# EAGLE design iv12-driver-board-v1b (EAGLE 7.7.0)

## Sheet 1 of 2
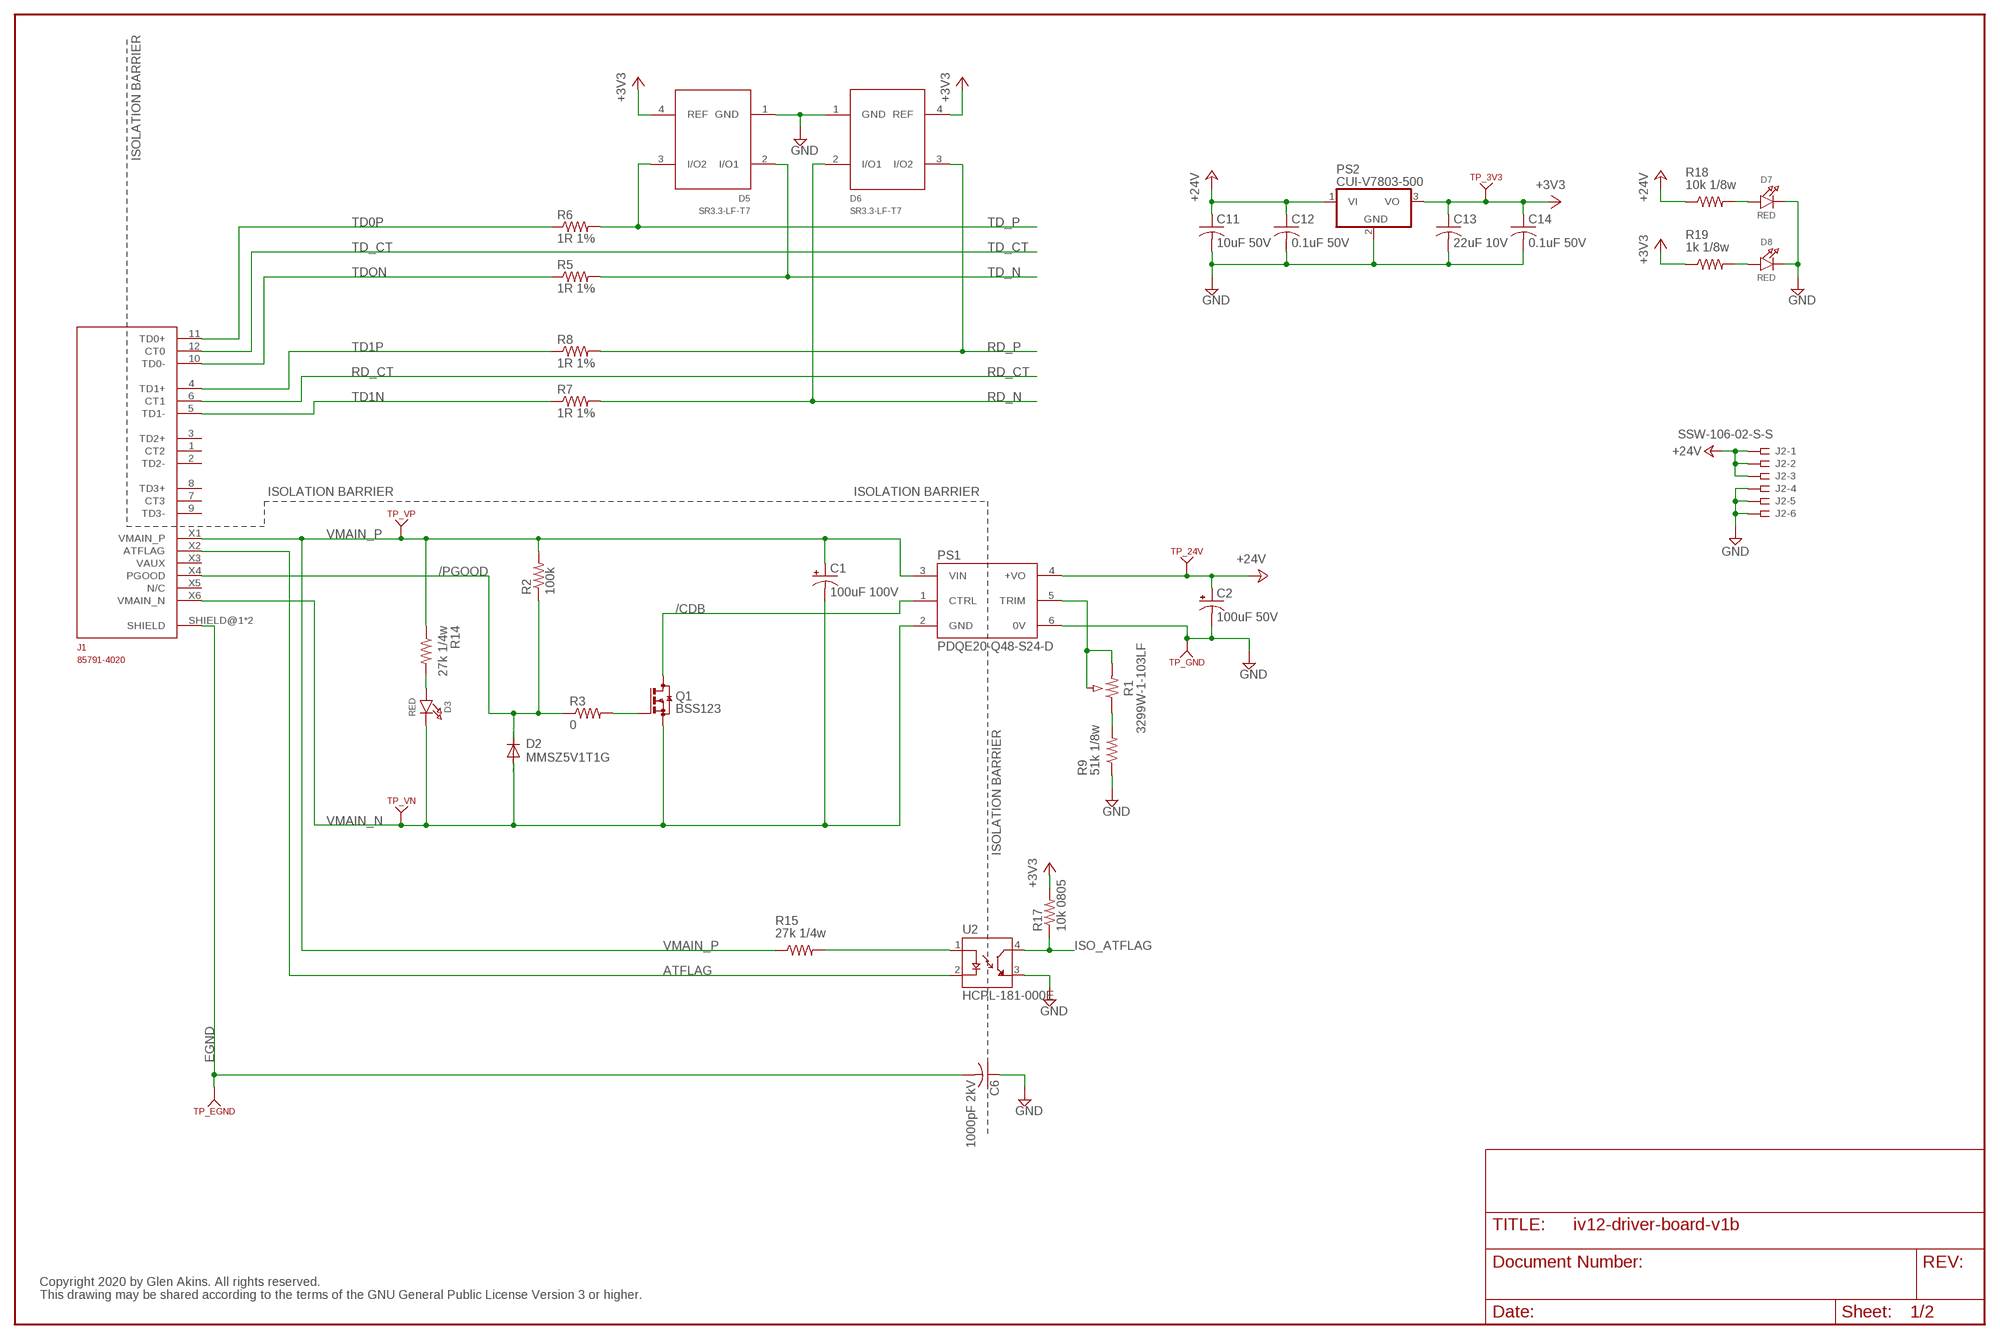
[diagram p0: schematic, sheet 1]

### Parts
C1  100uF 100V  CPOL-USE5-13  [E5-13]
C2  100uF 50V  CPOL-USE5-10.5  [E5-10,5]
C6  1000pF 2kV  C-USC1206K  [C1206K]
C11  10uF 50V  C-USC1210K  [C1210K]
C12  0.1uF 50V  C-USC0805  [C0805]
C13  22uF 10V  C-USC1206K  [C1206K]
C14  0.1uF 50V  C-USC0805  [C0805]
D2  MMSZ5V1T1G  DIODE-SOD123  [SOD123]
D3  RED  LED0805_NOOUTLINE  [CHIPLED_0805_NOOUTLINE]
D5  SR3.3-LF-T7  [SOT143B]
D6  SR3.3-LF-T7  [SOT143B]
D7  RED  LED0805_NOOUTLINE  [CHIPLED_0805_NOOUTLINE]
D8  RED  LED0805_NOOUTLINE  [CHIPLED_0805_NOOUTLINE]
J1  85791-4020  [85791-X020]
J2  SSW-106-02-S-S  [SSW-106-02-S-S]
PS1  PDQE20-Q48-S24-D  PDQE20-Q48-S5-D  [CONV_PDQE20-Q48-S5-D]
PS2  CUI-V7803-500  [CUI-78XX-500]
Q1  BSS123  [SOT23]
R1  3299W-1-103LF  [POT_3299W]
R2  100k  R-US_R0805  [R0805]
R3  0  R-US_R0805  [R0805]
R5  1R 1%  R-US_R0805  [R0805]
R6  1R 1%  R-US_R0805  [R0805]
R7  1R 1%  R-US_R0805  [R0805]
R8  1R 1%  R-US_R0805  [R0805]
R9  51k 1/8w  R-US_R0805  [R0805]
R14  27k 1/4w  R-US_R1206  [R1206]
R15  27k 1/4w  R-US_R1206  [R1206]
R17  10k 0805  R-US_R0805  [R0805]
R18  10k 1/8w  R-US_R0805  [R0805]
R19  1k 1/8w  R-US_R0805  [R0805]
TP_3V3  KEYSTONE_500X  [KEYSTONE_TP500X]
TP_24V  KEYSTONE_500X  [KEYSTONE_TP500X]
TP_EGND  KEYSTONE_500X  [KEYSTONE_TP500X]
TP_GND  KEYSTONE_500X  [KEYSTONE_TP500X]
TP_VN  KEYSTONE_500X  [KEYSTONE_TP500X]
TP_VP  KEYSTONE_500X  [KEYSTONE_TP500X]
U2  HCPL-181-000E  [SOIC254P675X240-4N]

### Nets
+3V3: C13.1 C14.1 D5.4(REF) D6.4(REF) PS2.3(VO) R17.2 R19.1 TP_3V3.1 ; also sheet 2
+24V: C2.+ C11.1 C12.1 J2.1 J2.2 J2.3 PS1.4(+VO) PS2.1(VI) R18.1 TP_24V.1
/CDB: PS1.1(CTRL) Q1.3(D)
/PGOOD: D2.C J1.X4(PGOOD) R2.1 R3.1
ATFLAG: J1.X2(ATFLAG) U2.2(CATHODE)
EGND: C6.2 J1.SHIELD@1(SHIELD) J1.SHIELD@2(SHIELD) TP_EGND.1
GND: C2.- C6.1 C11.2 C12.2 C13.2 C14.2 D5.1(GND) D6.1(GND) D7.C D8.C J2.4 J2.5 J2.6 PS1.6(0V) PS2.2(GND) R9.1 TP_GND.1 U2.3(EMITTER) ; also sheet 2
ISO_ATFLAG: R17.1 U2.4(COLLECTOR) ; also sheet 2
N$7: R1.1 R9.2
N$12: R15.2 U2.1(ANODE)
N$16: Q1.1(G) R3.2
N$22: D3.A R14.2
N$24: D7.A R18.2
N$25: D8.A R19.2
RD_CT: J1.6(CT1) ; also sheet 2
RD_N: D6.2(I/O1) R7.2 ; also sheet 2
RD_P: D6.3(I/O2) R8.2 ; also sheet 2
TD0P: J1.11(TD0+) R6.1
TD1N: J1.5(TD1-) R7.1
TD1P: J1.4(TD1+) R8.1
TD_CT: J1.12(CT0) ; also sheet 2
TD_N: D5.2(I/O1) R5.2 ; also sheet 2
TD_P: D5.3(I/O2) R6.2 ; also sheet 2
TDON: J1.10(TD0-) R5.1
V24ADJ: PS1.5(TRIM) R1.2 R1.3
VMAIN_N: C1.- D2.A D3.C J1.X6(VMAIN_N) PS1.2(GND) Q1.2(S) TP_VN.1
VMAIN_P: C1.+ J1.X1(VMAIN_P) PS1.3(VIN) R2.2 R14.1 R15.1 TP_VP.1
Unconnected: J1.1(CT2) J1.2(TD2-) J1.3(TD2+) J1.7(CT3) J1.8(TD3+) J1.9(TD3-) J1.X3(VAUX) J1.X5(N/C)

### Notes on the sheet
- ISOLATION BARRIER
- ISOLATION BARRIER | ISOLATION BARRIER
- ISOLATION BARRIER
- Copyright 2020 by Glen Akins. All rights reserved.
  This drawing may be shared according to the terms of the GNU General Public License Version 3 or higher.

## Sheet 2 of 2
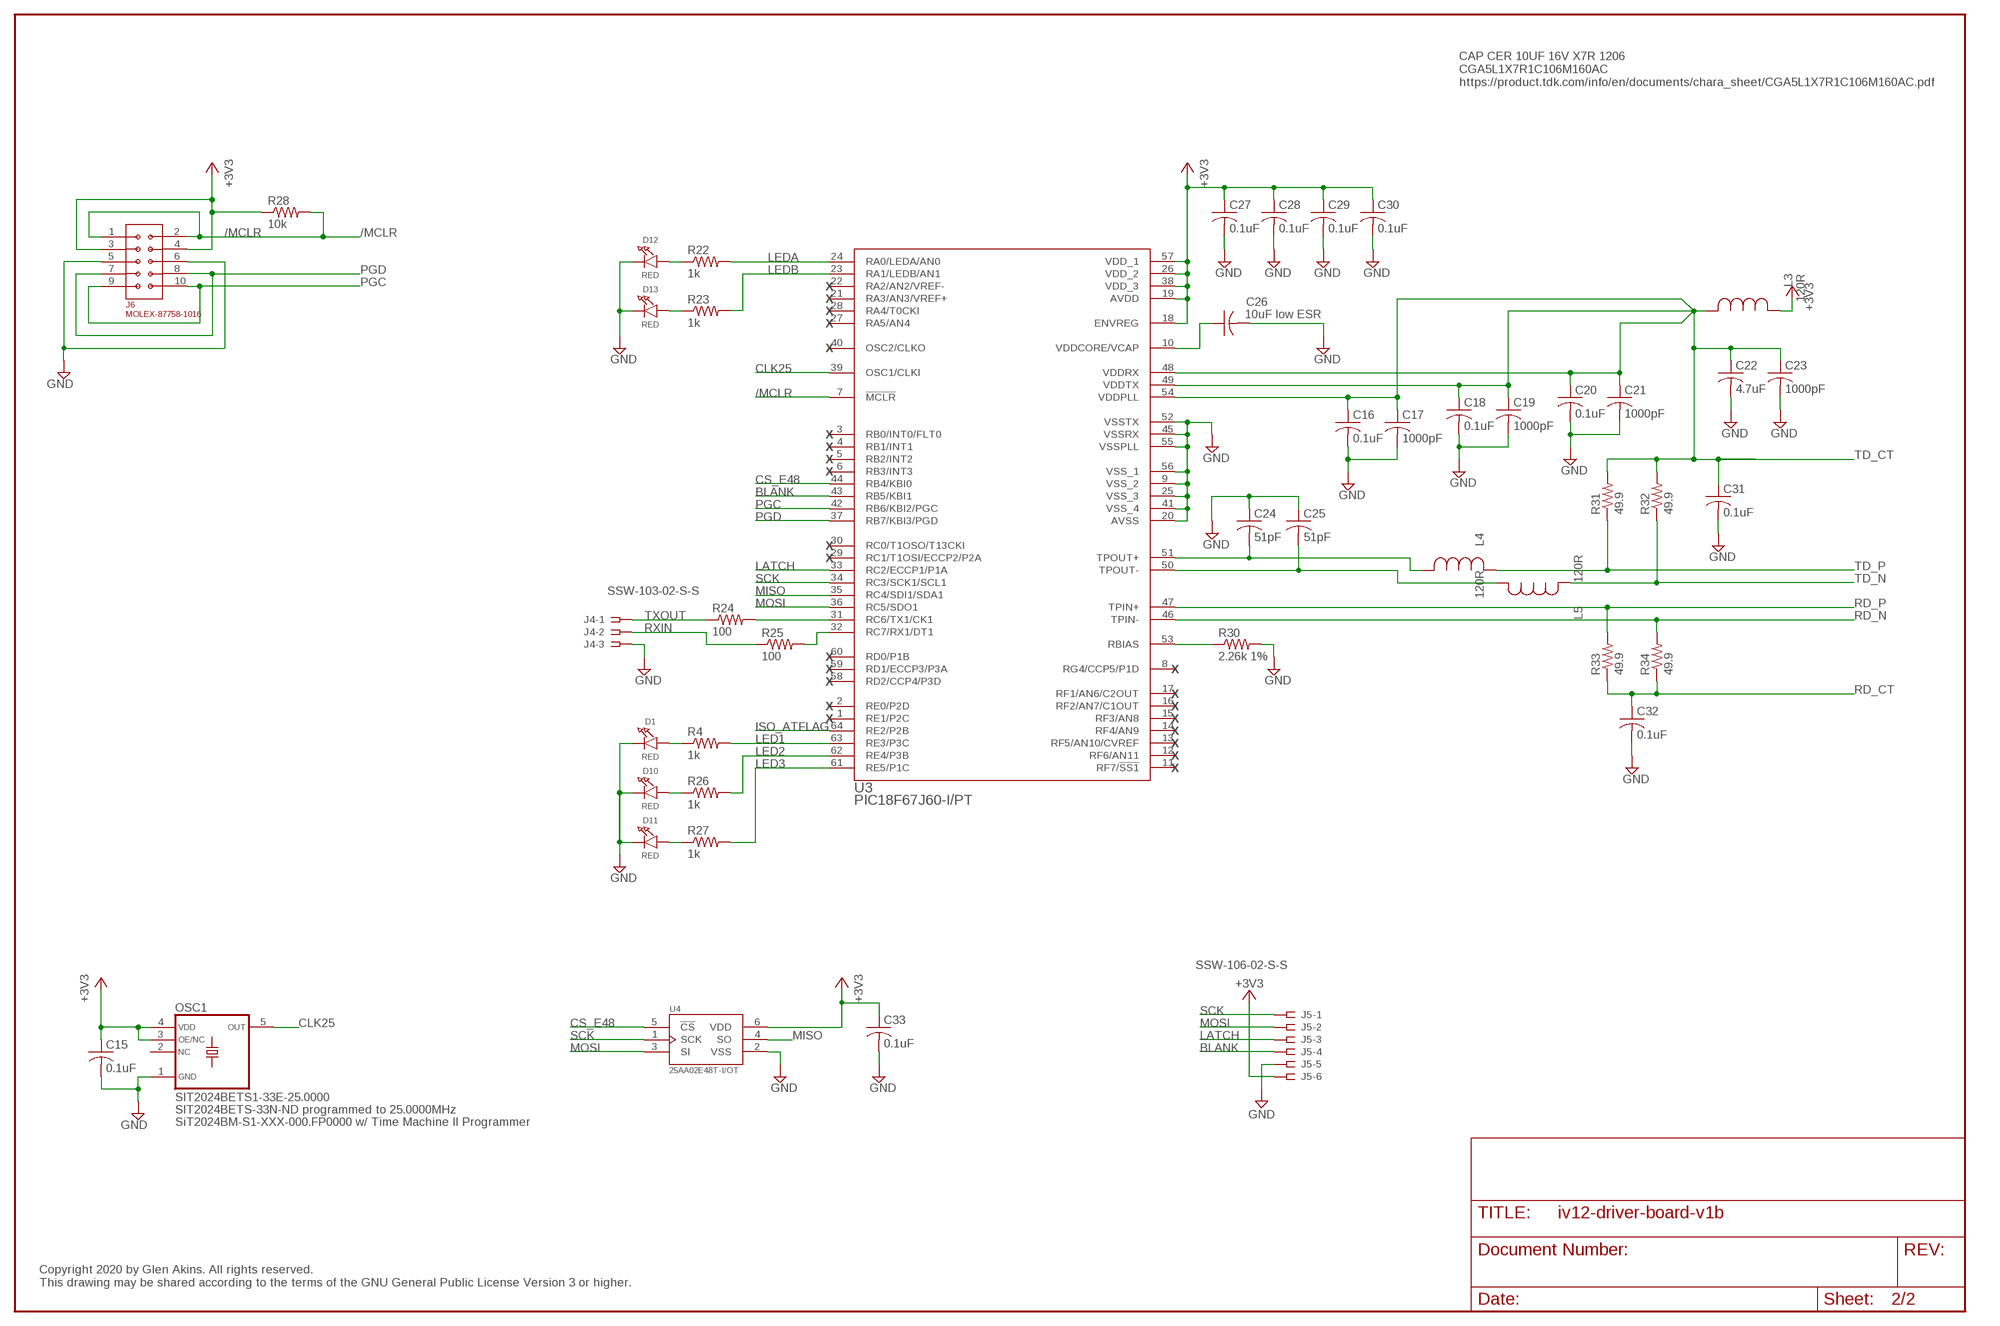
[diagram p1: schematic, sheet 2]

### Parts
C15  0.1uF  C-USC0603  [C0603]
C16  0.1uF  C-USC0805  [C0805]
C17  1000pF  C-USC0805  [C0805]
C18  0.1uF  C-USC0805  [C0805]
C19  1000pF  C-USC0805  [C0805]
C20  0.1uF  C-USC0805  [C0805]
C21  1000pF  C-USC0805  [C0805]
C22  4.7uF  C-USC0805  [C0805]
C23  1000pF  C-USC0805  [C0805]
C24  51pF  C-USC0805  [C0805]
C25  51pF  C-USC0805  [C0805]
C26  10uF low ESR  C-USC1206  [C1206]
C27  0.1uF  C-USC0603  [C0603]
C28  0.1uF  C-USC0603  [C0603]
C29  0.1uF  C-USC0603  [C0603]
C30  0.1uF  C-USC0603  [C0603]
C31  0.1uF  C-USC0805  [C0805]
C32  0.1uF  C-USC0805  [C0805]
C33  0.1uF  C-USC0603  [C0603]
D1  RED  LED0805_NOOUTLINE  [CHIPLED_0805_NOOUTLINE]
D10  RED  LED0805_NOOUTLINE  [CHIPLED_0805_NOOUTLINE]
D11  RED  LED0805_NOOUTLINE  [CHIPLED_0805_NOOUTLINE]
D12  RED  LED0805_NOOUTLINE  [CHIPLED_0805_NOOUTLINE]
D13  RED  LED0805_NOOUTLINE  [CHIPLED_0805_NOOUTLINE]
J4  SSW-103-02-S-S  [SSW-103-02-S-S]
J5  SSW-106-02-S-S  [SSW-106-02-S-S]
J6  MOLEX-87758-1016  CON-2MM-2X5-MOLEX-87758-1016  [CON-2MM-2X5]
L3  120R  MMZ1608B121CTAH0IND_1608-M  [IND_1608-M]
L4  120R  MMZ1608B121CTAH0IND_1608-M  [IND_1608-M]
L5  120R  MMZ1608B121CTAH0IND_1608-M  [IND_1608-M]
OSC1  SIT2024BETS1-33E-25.0000  SIT2024BETS1-33E-10.0000  [SOT23-5]
R4  1k  R-US_R0805  [R0805]
R22  1k  R-US_R0805  [R0805]
R23  1k  R-US_R0805  [R0805]
R24  100  R-US_R0805  [R0805]
R25  100  R-US_R0805  [R0805]
R26  1k  R-US_R0805  [R0805]
R27  1k  R-US_R0805  [R0805]
R28  10k  R-US_R0805  [R0805]
R30  2.26k 1%  R-US_R0805  [R0805]
R31  49.9  R-US_R0805  [R0805]
R32  49.9  R-US_R0805  [R0805]
R33  49.9  R-US_R0805  [R0805]
R34  49.9  R-US_R0805  [R0805]
U3  PIC18F67J60-I/PT  [TQFP64_10X10MC]
U4  25AA02E48T-I/OT  [SOT95P270X145-6N]

### Nets
+3V3: C15.1 C27.1 C28.1 C29.1 C30.1 C33.1 J5.6 J6.3 J6.4 L3.2 OSC1.3(OE/NC) OSC1.4(VDD) R28.1 U3.18(ENVREG) U3.19(AVDD) U3.26(VDD_2) U3.38(VDD_3) U3.57(VDD_1) U4.6(VDD) ; also sheet 1
/MCLR: J6.1 J6.2 R28.2 U3.7(!MCLR)
BLANK: J5.4 U3.43(RB5/KBI1)
CLK25: OSC1.5(OUT) U3.39(OSC1/CLKI)
CS_E48: U3.44(RB4/KBI0) U4.5(!CS)
GND: C15.2 C16.2 C17.2 C18.2 C19.2 C20.2 C21.2 C22.2 C23.2 C24.1 C25.1 C26.2 C27.2 C28.2 C29.2 C30.2 C31.2 C32.2 C33.2 D1.C D10.C D11.C D12.C D13.C J4.3 J5.5 J6.5 J6.6 OSC1.1(GND) R30.2 U3.9(VSS_2) U3.20(AVSS) U3.25(VSS_3) U3.41(VSS_4) U3.45(VSSRX) U3.52(VSSTX) U3.55(VSSPLL) U3.56(VSS_1) U4.2(VSS) ; also sheet 1
ISO_ATFLAG: U3.64(RE2/P2B) ; also sheet 1
LATCH: J5.3 U3.33(RC2/ECCP1/P1A)
LED1: R4.2 U3.63(RE3/P3C)
LED2: R26.2 U3.62(RE4/P3B)
LED3: R27.2 U3.61(RE5/P1C)
LEDA: R22.2 U3.24(RA0/LEDA/AN0)
LEDB: R23.2 U3.23(RA1/LEDB/AN1)
MISO: U3.35(RC4/SDI1/SDA1) U4.4(SO)
MOSI: J5.2 U3.36(RC5/SDO1) U4.3(SI)
N$1: D1.A R4.1
N$9: R30.1 U3.53(RBIAS)
N$10: D13.A R23.1
N$11: D10.A R26.1
N$18: D11.A R27.1
N$21: D12.A R22.1
PGC: J6.9 J6.10 U3.42(RB6/KBI2/PGC)
PGD: J6.7 J6.8 U3.37(RB7/KBI3/PGD)
RD_CT: C32.1 R33.1 R34.1 ; also sheet 1
RD_N: R34.2 U3.46(TPIN-) ; also sheet 1
RD_P: R33.2 U3.47(TPIN+) ; also sheet 1
RXD: R25.2 U3.32(RC7/RX1/DT1)
RXIN: J4.2 R25.1
SCK: J5.1 U3.34(RC3/SCK1/SCL1) U4.1(SCK)
TD_CT: C16.1 C17.1 C18.1 C19.1 C20.1 C21.1 C22.1 C23.1 C31.1 L3.1 R31.2 R32.2 U3.48(VDDRX) U3.49(VDDTX) U3.54(VDDPLL) ; also sheet 1
TD_N: L5.2 R32.1 ; also sheet 1
TD_P: L4.2 R31.1 ; also sheet 1
TDF_N: C25.2 L5.1 U3.50(TPOUT-)
TDF_P: C24.2 L4.1 U3.51(TPOUT+)
TXD: R24.2 U3.31(RC6/TX1/CK1)
TXOUT: J4.1 R24.1
VCAP: C26.1 U3.10(VDDCORE/VCAP)
Unconnected: OSC1.2(NC) U3.1(RE1/P2C) U3.2(RE0/P2D) U3.3(RB0/INT0/FLT0) U3.4(RB1/INT1) U3.5(RB2/INT2) U3.6(RB3/INT3) U3.8(RG4/CCP5/P1D) U3.11(RF7/!SS1) U3.12(RF6/AN11) U3.13(RF5/AN10/CVREF) U3.14(RF4/AN9) U3.15(RF3/AN8) U3.16(RF2/AN7/C1OUT) U3.17(RF1/AN6/C2OUT) U3.21(RA3/AN3/VREF+) U3.22(RA2/AN2/VREF-) U3.27(RA5/AN4) U3.28(RA4/T0CKI) U3.29(RC1/T1OSI/ECCP2/P2A) U3.30(RC0/T1OSO/T13CKI) U3.40(OSC2/CLKO) U3.58(RD2/CCP4/P3D) U3.59(RD1/ECCP3/P3A) U3.60(RD0/P1B)

### Notes on the sheet
- CAP CER 10UF 16V X7R 1206
  CGA5L1X7R1C106M160AC 
  https://product.tdk.com/info/en/documents/chara_sheet/CGA5L1X7R1C106M160AC.pdf
- X
- X
- X
- X
- X
- X
- X
- X
- X
- X
- X
- X
- X | X
- X
- X
- X | X
- X | X
- X
- X
- X
- X
- SIT2024BETS-33N-ND programmed to 25.0000MHz
- SiT2024BM-S1-XXX-000.FP0000 w/ Time Machine II Programmer
- Copyright 2020 by Glen Akins. All rights reserved.
  This drawing may be shared according to the terms of the GNU General Public License Version 3 or higher.

## Library data of the parts
C1 C2 = rcl:CPOL-US: POLARIZED CAPACITOR, American symbol
C6 C15-C25 C27-C33 = rcl:C-US: CAPACITOR, American symbol
C11 = rcl:C-US: CAPACITOR, American symbol; MFR: KEMET; MFR_PART_NO: C1210C106K5RACTU
C12 C14 = rcl:C-US: CAPACITOR, American symbol; MFR: KEMET; MFR_PART_NO: C1206S104M5RACTU
C13 = rcl:C-US: CAPACITOR, American symbol; MFR: KEMET; MFR_PART_NO: C1206C226K8RAC7800
C26 = resistor:C-US: CAPACITOR, American symbol
D1 D3 D7 D8 D10-D13 = microbuilder:LED: LED 0603 - 0603 Surface Mount Package 2mA: Green LED - Low Power (3.9mcd, 2ma, 1.7Vf) - Digikey: 475-2709-2-ND Orange LED - Low Power (9.8mcd, 2ma, 1.8Vf) - Digikey: 475-1194-2-ND Red LED - Low Power (5mcd, 2ma, 1.8Vf) - Digikey: 475-1195-2-ND Yellow LED - Low Power (7mcd, 2ma, 1.8Vf) - Digikey: 475-1196-2-ND 5mA: Blue LED - Low Power (17mcd, 5ma, 2.9Vf) - Digikey: LNJ937W8CRACT-ND 0805 - 0805 Surface Mount Package 2mA: Red LED (8.8mcd, 2mA, 1.8Vf, Clear) - Low Power [Digikey: 475-2510-1-ND] Green LED (5mcd, 2mA, 1.8Vf, Clear) - Low Power [Digikey: 475-2730-1-ND] Yellow LED (11.3mcd, 2mA, 1.8Vf, Clear) - Low Power [Digikey: 475-2555-1-ND] 20mA: Red LED (104mcd, 20mA, Diffused) - LS R976 [Digikey: 475-1278-6-ND] Red LED (12mcd, 20mA, 2.0Vf, Clear) - APT2012EC [Digikey: 754-1128-1-ND] Green LED (15mcd, 20mA, 2.2Vf, Clear) - APT2012GC [Digikey: 754-1131-1-ND] Orange LED (160mcd, 20mA, 2.1Vf, Clear) - APT2012SECK [Digikey: 754-1130-1-ND] 1206 - 1206 Surface Mount Package Green LED (26mcd, 20mA, Diffused) - LG N971 [Digikey: 475-1407-6-ND] Red LED (15mcd, 20mA, Diffused) - LH N974 [Digikey: 475-1416-6-ND] Cree - Cree High-Power Surface Mount LEDs XPEBWT-L1-0000-00D50 - White 111lm 350mA 2.9Vf 6200K 110° XTEAWT-00-0000-00000LEE3 - White 114lm 350mA 2.85Vf 5000K 115° Everlight - Everlight 45-21 Series Surface Mount LEDs 45-21/QK2C-B2832AC2CB2/2T - Warm White 2000mcd 20mA 3.25Vf 3050K 120° 45-21/LK2C-B38452C4CB2/2T - Nuetral White 2000mcd 20mA 3.25Vf 4150K 120° 45-21/LK2C-B50634C6CB2/2T - Cold White 2200mcd 20mA 3.25Vf 5650K 120° PLCC2 Reverse Mount LS T77K-J1L2-1-0-2-R18-Z - Red 11.25mcd 2mA 1.8Vf 630nm 120° LO T77K-L1M2-24-Z - Orange 19.6mcd 2mA 1.8Vf 606nm 120° LY T77K-K2M1-26-Z - Yellow 15.7mcd 2mA 1.8Vf 587nm 120°
D2 = diode:DIODE-: DIODE
D5 D6 = protek-devices:SR3.3-LF-T7
J1 = Molex 85791-X020:85791-4020
J2 J5 = con-samtec:SSW-106-02-S-S: THROUGH-HOLE .025" SQ POST SOCKET Source: Samtec SSW.pdf; MPN: SSW-106-02-S-S; OC_FARNELL: unknown; OC_NEWARK: 11P9416
J4 = con-samtec:SSW-103-02-S-S: THROUGH-HOLE .025" SQ POST SOCKET Source: Samtec SSW.pdf; MPN: SSW-103-02-S-S; OC_FARNELL: unknown; OC_NEWARK: 11P9367
J6 = 0GlenConnectors:CON-2MM-2X5-MOLEX-87758-1016; MFR: MOLEX; MFR_PART_NO: 87758-1016
L3-L5 = MMZ1608B121CTAH0:MMZ1608B121CTAH0; BUILT_BY: EMA_UL_Team; MANUFACTURER_PART_NUMBER: MMZ1608B121CTAH0; VENDOR: TDK
OSC1 = Glen-SiTime:SIT2024BETS1-33E-10.0000
PS1 = PDQE20-Q48-S5-D:PDQE20-Q48-S5-D: 20 W, 4:1 Input Range, Single/Dual Regulated Output, DIP, 1500 Vdc Isolation, DC-Dc Converter; CUI_PURCHASE_URL: https://www.cui.com/product/dc-dc-converters/isolated/pdqe20-d-series?utm_source=snapeda.com&utm_medium=referral&utm_campaign=snapedaBOM; DESCRIPTION: 20 W, 4:1 Input Range, Single/Dual Regulated Output, DIP, 1500 Vdc Isolation, Dc-Dc Converter; DIGI-KEY_PART_NUMBER: 102-6272-ND; DIGI-KEY_PURCHASE_URL: https://www.digikey.com/product-detail/en/cui-inc/PDQE20-Q48-S5-D/102-6272-ND/10230161?utm_source=snapeda&utm_medium=aggregator&utm_campaign=symbol; MF: CUI Inc.; MP: PDQE20-Q48-S5-D; PACKAGE: DIP-6 CUI Inc.
PS2 = GlenPartsLibrary:CUI-V7803-500
Q1 = transistor-small-signal:BSS123: N-CHANNEL MOS FET
R1 = bourns-3299w:3299W-1-103LF
R2 R3 R17 = resistor:R-US_: RESISTOR, American symbol
R4-R9 R14 R15 R18 R19 R22-R28 R30-R34 = rcl:R-US_: RESISTOR, American symbol
TP_3V3 TP_24V TP_EGND TP_GND TP_VN TP_VP = 0GlenConnectors:KEYSTONE_500X
U2 = HCPL-181-000E:HCPL-181-000E: Optocoupler; SMD; Channels: 1; Out: transistor; Uinsul: 3.75kV; SO4; DESCRIPTION: Optocoupler; SMD; Channels: 1; Out: transistor; Uinsul: 3.75kV; SO4; DIGI-KEY_PART_NUMBER: 516-1646-1-ND; DIGI-KEY_PURCHASE_URL: https://www.digikey.com/product-detail/en/broadcom-limited/HCPL-181-000E/516-1646-1-ND/825340?utm_source=snapeda&utm_medium=aggregator&utm_campaign=symbol; MF: Broadcom Limited; MP: HCPL-181-000E; PACKAGE: SO-4 Broadcom
U3 = pic18f67j60:PIC18F67J60-I/PT; MANUFACTURER_PART_NUMBER: PIC18F67J60IPT; VENDOR: Microchip
U4 = 25AA02E48T-I_OT:25AA02E48T-I/OT: 25AA02E48 Series 2 Kbit (256 x 8) 5.5 V SMT SPI Bus Serial EEPROM - SOT-23-6; DESCRIPTION: 25AA02E48 Series 2 Kbit _256 x 8_ 5.5 V SMT SPI Bus Serial EEPROM - SOT-23-6; DIGI-KEY_PART_NUMBER: 25AA02E48T-I/OTCT-ND; DIGI-KEY_PURCHASE_URL: https://www.digikey.com/product-detail/en/microchip-technology/25AA02E48T-I-OT/25AA02E48T-I-OTCT-ND/2060055?utm_source=snapeda&utm_medium=aggregator&utm_campaign=symbol; MF: Microchip; MP: 25AA02E48T-I/OT; PACKAGE: SOT-23-6 Microchip

## Board
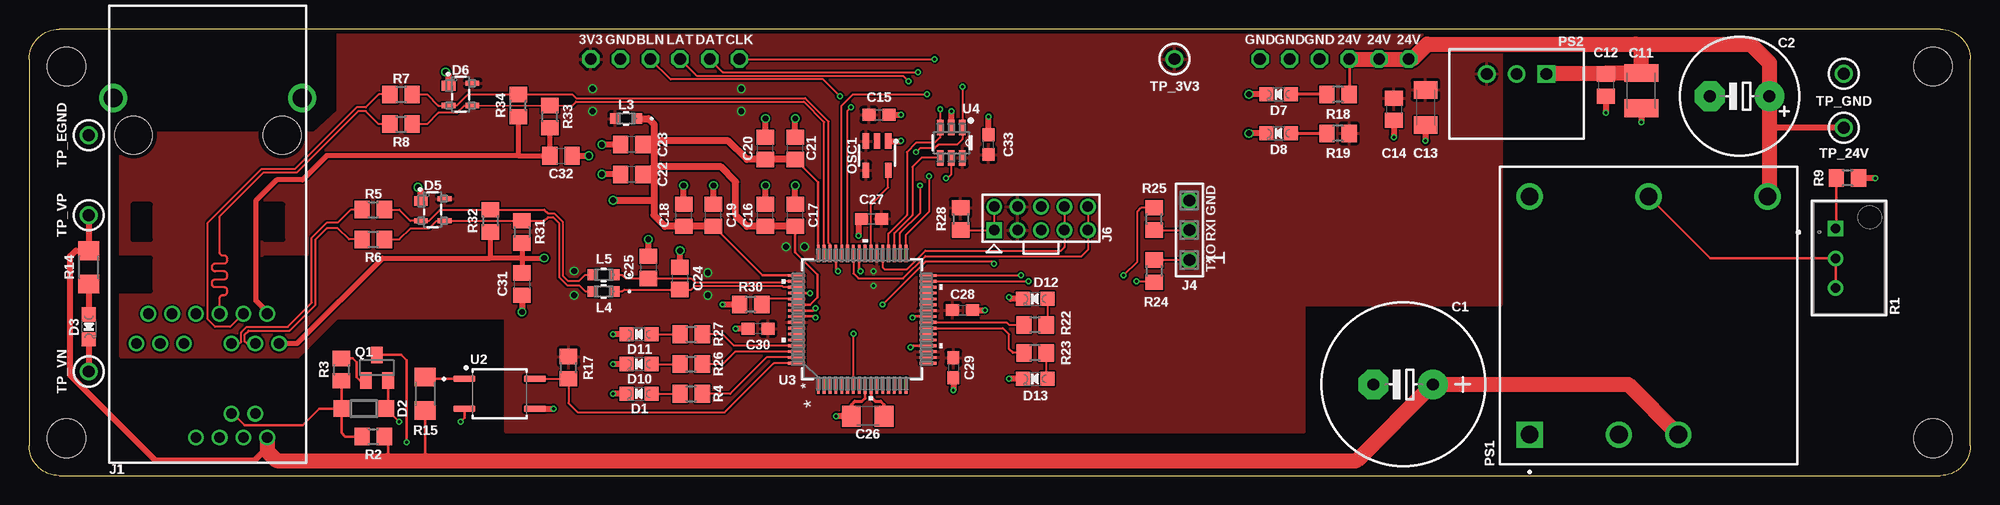
[diagram p2: board, top side]
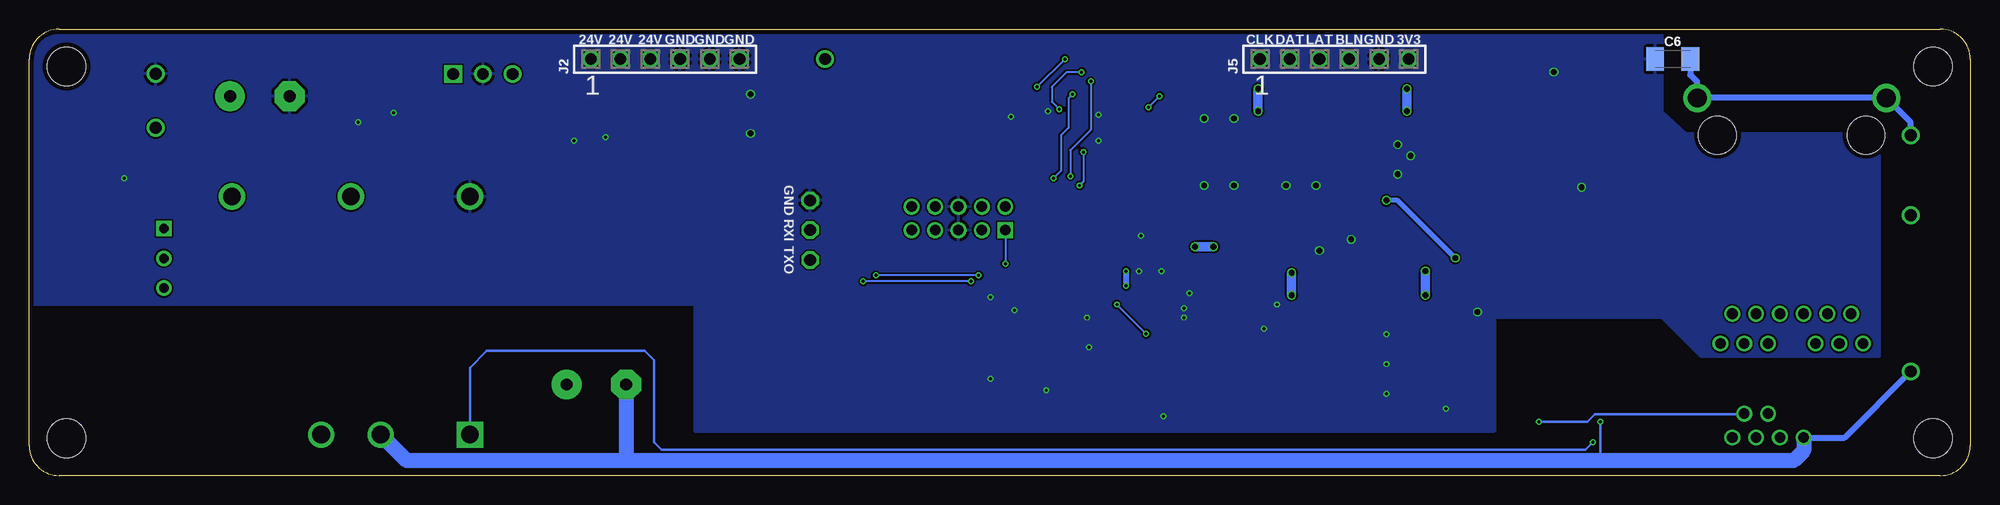
[diagram p3: board, bottom side, seen from below]

Size 165.74 x 38.1 mm. Coordinates in mm from the lower left corner, seen from the top.
Outline: 2.54,0 163.2,0 arc90 165.74,2.54 165.74,35.56 arc90 163.2,38.1 2.54,38.1 arc90 0,35.56 0,2.54 arc90 2.54,0
Copper layers (1*16): Top 0.035559375mm / dielectric 1.6mm / Bottom 0.035559375mm
Design rules "oshpark-2layer-2018": minimum track width 6mil, minimum drill 10mil, track to track 6mil, track to pad 6mil, pad to pad 6mil, via to via 6mil, smd to smd 6mil, copper to edge 15mil, drill to drill 6mil, minimum pad ring 5mil, minimum via ring 5mil, stop-mask expansion 2.5mil, vias tented up to drill 0mil, thermal gap 10mil
Holes 3.3 mm at 3.17,3.17 162.56,34.92 3.17,34.92 162.56,3.17

### Footprints (pad centres in the part's own frame; a part is rotated, then mirrored left to right if it is on the bottom)
E5-13 = drill 1.016 pad 2.54: + -2.54,0 | drill 1.016 pad 2.54 octagon: - 2.54,0
E5-10,5 = drill 1.016 pad 2.54: + -2.54,0 | drill 1.016 pad 2.54 octagon: - 2.54,0
C1206K = smd 1.5 x 2: 1 -1.5,0; 2 1.5,0
C1210K = smd 1.5 x 2.9: 1 -1.5,0; 2 1.5,0
C0805 = smd 1.3 x 1.5: 1 -0.95,0; 2 0.95,0
C0603 = smd 1.1 x 1: 1 -0.85,0; 2 0.85,0
C1206 = smd 1.6 x 1.8: 1 -1.4,0; 2 1.4,0
CHIPLED_0805_NOOUTLINE = smd 1.2 x 1.2: A 0,-1.05; C 0,1.05
SOD123 = smd 1.4 x 1.4: A 1.9,0; C -1.9,0
SOT143B = smd 0.838 x 1.168: 1 -0.747,-1.016 | smd 0.432 x 1.168: 2 0.95,-1.016; 3 0.95,1.016; 4 -0.95,1.016
85791-X020 = drill 0.9: 1 15.24,-5.075; 2 15.24,-3.045; 3 15.24,-1.015; 4 15.24,1.015; 5 15.24,3.045; 6 15.24,5.075; 7 17.78,-6.09; 8 17.78,-4.06; 9 17.78,-2.03; 10 17.78,2.03; 11 17.78,4.06; 12 17.78,6.09; X1 25.81,5.075; X2 23.77,4.06; X3 25.81,3.045; X4 23.77,2.03; X5 25.81,1.015; X6 25.81,-1.015 | drill 1.6: SHIELD@1 -3.18,8.065; SHIELD@2 -3.18,-8.065 | hole 3.2: 0,-6.35; 0,6.35
SSW-106-02-S-S = drill 1 pad 1.5 octagon: 1 -6.35,0; 2 -3.81,0; 3 -1.27,0; 4 1.27,0; 5 3.81,0; 6 6.35,0
SSW-103-02-S-S = drill 1 pad 1.5 octagon: 1 -2.54,0; 2 0,0; 3 2.54,0
CON-2MM-2X5 = drill 0.9 pad 1.27 square: 1 0,0 | drill 0.9 pad 1.27: 2 2,0; 3 0,-2; 4 2,-2; 5 0,-4; 6 2,-4; 7 0,-6; 8 2,-6; 9 0,-8; 10 2,-8
IND_1608-M = smd 0.859 x 0.902: 1 -0.929,0; 2 0.929,0
SOT23-5 = smd 1.3 x 0.55: 1 -1.25,0.95; 2 -1.25,0; 3 -1.25,-0.95; 4 1.25,-0.95; 5 1.25,0.95
CONV_PDQE20-Q48-S5-D = drill 1.5 square: 1 -10.16,10.16 | drill 1.5: 2 -10.16,2.54; 3 -10.16,-2.54; 4 10.16,-10.16; 5 10.16,0; 6 10.16,10.16
CUI-78XX-500 = drill 1 square: 1 0,0 | drill 1: 2 2.54,0; 3 5.08,0
SOT23 = smd 1 x 1.4: 1 -0.95,-1.1; 2 0.95,-1.1; 3 0,1.1
POT_3299W = drill 0.813 pad 1.321 square: 1 -5.055,-2.286 | drill 0.813 pad 1.321: 2 -2.515,-2.286; 3 0.025,-2.286
R0805 = smd 1.3 x 1.5: 1 -0.95,0; 2 0.95,0
R1206 = smd 1.6 x 1.803: 1 -1.422,0; 2 1.422,0
KEYSTONE_TP500X = drill 1.016: 1 0,0
SOIC254P675X240-4N = smd 1.89 x 0.59: 1 -3.01,1.27; 2 -3.01,-1.27; 3 3.01,-1.27; 4 3.01,1.27
TQFP64_10X10MC = smd 1.473 x 0.229: 1 -5.613,3.75; 2 -5.613,3.25; 3 -5.613,2.75; 4 -5.613,2.25; 5 -5.613,1.75; 6 -5.613,1.25; 7 -5.613,0.75; 8 -5.613,0.25; 9 -5.613,-0.25; 10 -5.613,-0.75; 11 -5.613,-1.25; 12 -5.613,-1.75; 13 -5.613,-2.25; 14 -5.613,-2.75; 15 -5.613,-3.25; 16 -5.613,-3.75; 33 5.613,-3.75; 34 5.613,-3.25; 35 5.613,-2.75; 36 5.613,-2.25; 37 5.613,-1.75; 38 5.613,-1.25; 39 5.613,-0.75; 40 5.613,-0.25; 41 5.613,0.25; 42 5.613,0.75; 43 5.613,1.25; 44 5.613,1.75; 45 5.613,2.25; 46 5.613,2.75; 47 5.613,3.25; 48 5.613,3.75 | smd 0.229 x 1.473: 17 -3.75,-5.613; 18 -3.25,-5.613; 19 -2.75,-5.613; 20 -2.25,-5.613; 21 -1.75,-5.613; 22 -1.25,-5.613; 23 -0.75,-5.613; 24 -0.25,-5.613; 25 0.25,-5.613; 26 0.75,-5.613; 27 1.25,-5.613; 28 1.75,-5.613; 29 2.25,-5.613; 30 2.75,-5.613; 31 3.25,-5.613; 32 3.75,-5.613; 49 3.75,5.613; 50 3.25,5.613; 51 2.75,5.613; 52 2.25,5.613; 53 1.75,5.613; 54 1.25,5.613; 55 0.75,5.613; 56 0.25,5.613; 57 -0.25,5.613; 58 -0.75,5.613; 59 -1.25,5.613; 60 -1.75,5.613; 61 -2.25,5.613; 62 -2.75,5.613; 63 -3.25,5.613; 64 -3.75,5.613
SOT95P270X145-6N = smd 1.321 x 0.559: 1 -1.295,0.94; 2 -1.295,0; 3 -1.295,-0.94; 4 1.295,-0.94; 5 1.295,0; 6 1.295,0.94

### Placement (x,y rotation side)
C1  117.32,7.78 180 top
C2  146.05,32.38 180 top
C6  25.4,35.56 0 bottom
C11  137.64,32.86 270 top
C12  134.62,33.34 270 top
C13  119.22,31.43 270 top
C14  116.52,31.27 270 top
C15  72.55,30.8 0 top
C16  62.86,22.23 90 top
C17  65.41,22.23 90 top
C18  55.88,22.23 90 top
C19  58.42,22.23 90 top
C20  62.86,27.94 90 top
C21  65.41,27.94 90 top
C22  51.43,25.72 180 top
C23  51.43,28.26 180 top
C24  55.56,16.83 270 top
C25  52.86,17.78 270 top
C26  71.6,5.08 180 top
C27  71.91,21.91 180 top
C28  79.69,14.13 0 top
C29  78.9,9.21 270 top
C30  62.23,12.54 180 top
C31  42.07,16.35 270 top
C32  45.4,27.3 0 top
C33  81.91,28.26 90 top
D1  52.07,6.99 90 top
D2  28.58,5.71 0 top
D3  5.08,12.7 180 top
D5  34.45,22.7 270 top
D6  36.83,32.54 270 top
D7  106.68,32.54 90 top
D8  106.68,29.21 90 top
D10  52.07,9.53 90 top
D11  52.07,12.06 90 top
D12  85.88,15.08 90 top
D13  85.88,8.26 90 top
J1  15.24,29.06 270 top
J2  111.44,35.56 0 bottom
J4  99.06,20.95 90 top
J5  54.29,35.56 0 bottom
J6  82.39,20.95 90 top
L3  50.96,30.48 180 top
L4  49.05,15.72 180 top
L5  49.05,17.14 180 top
OSC1  72.39,27.3 270 top
PS1  138.27,13.65 90 top
PS2  129.54,34.29 180 top
Q1  29.69,9.21 0 top
R1  156.53,16.03 270 top
R2  29.37,3.33 0 top
R3  26.67,9.05 90 top
R4  56.52,6.99 0 top
R5  29.37,22.7 0 top
R6  29.37,20.16 0 top
R7  31.75,32.54 0 top
R8  31.75,30 0 top
R9  155.26,25.4 180 top
R14  5.08,17.78 270 top
R15  33.81,6.99 90 top
R17  46.04,9.21 90 top
R18  111.76,32.54 180 top
R19  111.76,29.21 180 top
R22  85.88,12.86 180 top
R23  85.88,10.48 180 top
R24  96.04,17.46 270 top
R25  96.04,21.91 90 top
R26  56.52,9.53 0 top
R27  56.52,12.06 0 top
R28  79.53,21.91 270 top
R30  61.59,14.61 180 top
R31  42.07,20.8 270 top
R32  39.37,21.75 270 top
R33  44.45,30.64 90 top
R34  41.75,31.59 90 top
TP_3V3  97.79,35.56 180 top
TP_24V  154.94,29.69 0 top
TP_EGND  5.08,29.06 90 top
TP_GND  154.94,34.29 270 top
TP_VN  5.08,8.89 90 top
TP_VP  5.08,22.23 90 top
U2  40.16,6.99 0 top
U3  71.12,13.34 90 top
U4  78.74,28.42 270 top

### Tracks (layer width: path | path; a pad name or v marks a point on that pad's centre or on a via)
+3V3  (via drill 0.25, 0.5)
  Bottom 0.508: v72.07,17.46 v72.07,16.19
  Bottom 0.813: v48.1,31.11 v48.1,33.02 | v64.61,19.53 v66.2,19.53 | v46.51,15.4 v46.51,17.46 | v57.94,15.4 v57.94,17.3 | v60.8,31.11 v60.8,33.02
  pour Top (isolate 0.152, rank 2): 26.35,38.1 26.35,31.11 24.29,29.21 7.78,29.21 7.78,10.16 23.02,10.16 26.35,13.49 26.51,13.49 40.64,13.49 40.64,3.75 108.9,3.75 108.9,14.61 125.73,14.61 125.73,38.1
+24V
  Top 0.203: 148.91,29.69 148.59,30
  Top 0.254: J2.3 R18.1
  Top 0.508: TP_24V.1 148.91,29.69
  Top 1.27: 137.16,36.83 147,36.83 148.59,35.24 C2.+ 148.59,30 148.59,23.97 PS1.4 | 137.16,36.83 137.64,36.35 C11.1 134.69,34.36 C12.1 PS2.1 | J2.3 J2.2 J2.1 118.11,35.56 119.38,36.83 137.16,36.83
/CDB  (via drill 0.25)
  Top 0.203: Q1.3 31.76,10.31 32.23,9.84 v32.23,2.86
  Bottom 0.203: v32.23,2.86 32.86,2.22 111.76,2.22 112.39,2.86 112.39,9.84 113.19,10.64 126.68,10.64 128.11,9.21 PS1.1
/MCLR  (via drill 0.25)
  Top 0.152: U3.7 v70.37,12.11 | v82.39,18.1 82.23,18.26 76.52,18.26 v72.87,14.61 | R28.2 J6.1 J6.2
  Bottom 0.152: v70.37,12.11 v72.87,14.61 | J6.1 v82.39,18.1
/PGOOD
  Top 0.152: D2.C | J1.X4 17.41,5.29
  Top 0.203: R3.1 D2.C 26.67,3.65 26.99,3.33 R2.1 | 17.41,5.29 18.41,4.29 23.34,4.29 24.77,5.71 D2.C
ATFLAG  (via drill 0.25)
  Top 0.203: U2.2 37.15,4.93 v36.83,4.6
  Bottom 0.152: 19.35,5.24 J1.X2
  Bottom 0.203: v36.83,4.6 32.7,4.6 32.07,5.24 19.35,5.24
BLANK  (via drill 0.25)
  Top 0.152: U3.43 69.87,31.14 v70.17,31.43 | v69.22,32.38 67.79,33.81 54.77,33.81 J5.4
  Bottom 0.152: v70.17,31.43 v69.22,32.38
CLK25
  Top 0.152: U3.39 71.87,23.13 73.34,24.61 OSC1.5
  Top 0.254: OSC1.5
CS_E48  (via drill 0.25)
  Top 0.152: U3.44 69.37,31.59 70.33,32.54 v76.68,32.54 | v78.26,25.4 78.42,25.4 78.74,25.72 U4.5
  Bottom 0.152: v76.68,32.54 76.99,32.23 76.99,29.69 77.63,29.05 77.63,26.04 v78.26,25.4
EGND
  Bottom 0.406: 23.34,32.27 J1.SHIELD@1
  Bottom 0.508: TP_EGND.1 5.08,30.14 J1.SHIELD@2 J1.SHIELD@1 | C6.2 23.9,34.22 23.34,33.66 23.34,32.27
GND  (via drill 0.25, 0.5)
  Top 0.152: 74.43,28.55 v74.45,28.57 | C27.2 70.96,21.91 70.8,21.75
  Top 0.229: U3.20 75.38,11.09 v75.25,10.95 | U3.25 75.5,13.59 v75.41,13.49 | U3.41 70.87,17.55 v70.96,17.46 | U3.45 68.87,17.65 v69.06,17.46 | U3.52 66.65,15.59 v66.67,15.56 | U3.55 66.88,14.09 v67.15,14.29 | U3.56 67.06,13.59 v67.15,13.49 | U3.9 71.37,6.6
  Top 0.254: C26.2 70.2,6.06 70.48,6.35 71.12,6.35 71.37,6.6
  Top 0.508: C20.2 v62.86,30.48 | C21.2 v65.41,30.48 | C17.2 v65.41,24.77 | C16.2 v62.86,24.77 | C19.2 v58.42,24.77 | C18.2 v55.88,24.77 | C23.2 v48.89,28.26 | C22.2 v48.89,25.72 | C32.2 v47.78,27.3 | D6.1 35.81,34.2 v35.56,34.45 | D5.1 33.43,24.35 v33.18,24.61 | C25.1 v52.86,20.16 | C24.1 v55.56,19.21 | D7.C v104.14,32.54 | D8.C v104.14,29.21 | C31.2 v42.07,13.97 | D10.C v49.85,9.53 | D11.C v49.85,12.06 | R30.2 v59.21,14.61 | OSC1.1 74.43,28.55 | U4.2 v78.74,31.11 | C33.2 v81.91,30.64 | C28.2 v81.6,14.13 | C29.2 v78.9,7.3 | C30.2 v60.32,12.54 | 70.8,21.75 v70.8,20.48 | C15.2 v74.45,30.8 | D12.C 83.82,15.08 v83.66,15.24 | D13.C v83.66,8.26 | C26.2 v68.9,5.08 | U2.3 v44.77,5.71 | v157.64,25.4 R9.1 | D1.C v49.85,6.99 | C12.2 v134.62,30.96 | C11.2 v137.64,30.16 | C13.2 v119.22,28.57 | C14.2 v116.52,28.89
  pour Bottom (isolate 0.152): 165.74,38.1 26.35,38.1 26.35,31.11 24.29,29.21 7.78,29.21 7.78,10.16 23.02,10.16 26.35,13.49 40.64,13.49 40.64,3.75 108.9,3.75 108.9,14.61 165.74,14.61
ISO_ATFLAG
  Top 0.152: U2.4 R17.1 46.04,6.19 46.83,5.4 59.37,5.4 63.56,9.59 U3.64
LATCH  (via drill 0.25)
  Top 0.152: v75.09,33.66 74.61,34.13 56.99,34.13 J5.3 | v76.83,25.56 76.83,22.54 74.87,20.58 U3.33
  Bottom 0.152: v75.09,33.66 75.09,29.53 76.83,27.78 v76.83,25.56
LED1
  Top 0.152: U3.63 62.95,10.09 59.85,6.99 R4.2
LED2
  Top 0.152: U3.62 60.27,10.59 59.21,9.53 R26.2
LED3
  Top 0.152: U3.61 60.19,11.09 59.21,12.06 R27.2
LEDA
  Top 0.152: U3.24 83.44,13.09 83.66,12.86 R22.2
LEDB
  Top 0.152: U3.23 83.14,12.59 83.66,12.06 83.66,10.79 83.98,10.48 R23.2
MISO
  Top 0.152: 77.79,27.11 U4.4 76.17,27.12 75.41,26.35 75.41,22.23 73.87,20.69 U3.35
MOSI  (via drill 0.25)
  Top 0.152: U3.36 73.37,20.66 74.93,22.23 74.93,27.62 75.72,28.42 77.31,28.42 77.77,28.88 77.77,29.69 U4.3 77.79,29.72 v77.79,31.27 | v75.88,34.45 59.21,34.45 J5.2
  Bottom 0.152: v75.88,34.45 77.15,34.45 78.42,33.18 78.42,31.91 v77.79,31.27
N$1
  Top 0.152: D1.A R4.1
N$7
  Top 0.203: R9.2 154.31,21.15 R1.1
N$9
  Top 0.152: U3.53 63.02,15.09 R30.1
N$10
  Top 0.152: R23.1 86.83,8.36 D13.A
N$11
  Top 0.152: D10.A R26.1
N$12
  Top 0.203: U2.1 34.44,8.26 R15.2
N$16
  Top 0.203: R3.2 27.62,10 27.94,9.68 27.94,8.41 28.25,8.11 Q1.1
N$18
  Top 0.152: D11.A R27.1
N$21
  Top 0.152: D12.A 86.93,12.96 R22.1
N$22
  Top 0.508: R14.2 D3.A
N$24
  Top 0.254: R18.2 D7.A
N$25
  Top 0.254: D8.A R19.2
PGC
  Top 0.152: U3.42 70.37,17.26 70.8,16.83 74.61,16.83 76.52,18.73 89.85,18.73 90.39,19.27 J6.9 J6.10
PGD
  Top 0.152: U3.37 72.87,17.78 73.02,17.62 74.93,17.62 76.52,19.21 88.11,19.21 88.39,19.49 J6.7 J6.8
RD_CT
  Top 0.406: 41.75,27.3 C32.1 44.45,28.73 R33.1 | R34.1 41.75,27.3 | J1.6 20.31,13.97 19.37,14.92 19.37,23.5 21.11,25.24 23.34,25.24 25.4,27.3 41.75,27.3
RD_N
  Top 0.152: R7.2 33.97,32.54 34.92,31.59 D6.2 36.52,31.59 37.46,32.54 R34.2 | 42.07,32.86 42.07,32.55 | 42.07,32.55 42.07,32.54 | U3.46 68.37,19.74 68.26,19.84 68.26,30.22 66.26,32.22 46.67,32.22 46.35,32.54 R34.2 | R34.2 42.07,32.55
RD_P
  Top 0.152: U3.47 67.87,30.18 66.14,31.91 46.67,31.91 46.35,31.59 R33.2 D6.3 37.15,31.59 36.51,30.96 34.92,30.96 33.97,30 R8.2
RXD  (via drill 0.25)
  Top 0.152: U3.32 v84.67,17.09 | v93.44,17.09 94.61,18.26 94.61,22.54 94.93,22.86 R25.2
  Bottom 0.152: v84.67,17.09 v93.44,17.09
RXIN
  Top 0.152: R25.1 J4.2
SCK  (via drill 0.25)
  Top 0.152: 79.69,29.7 U4.1 | U4.1 79.68,28.72 79.22,28.26 77.63,28.26 77.31,27.94 76.04,27.94 v75.72,27.62 | v76.04,24.77 76.04,22.38 74.37,20.71 U3.34 | J5.1 v77.31,35.56 | v79.69,33.18 79.69,29.72 U4.1
  Bottom 0.152: v75.72,27.62 75.72,25.08 v76.04,24.77 | v77.31,35.56 v79.69,33.18
TD0P
  Top 0.152: J1.11 18.57,11.28 18.41,11.43 18.41,12.06 18.73,12.38 22.23,12.38 24.45,14.61 24.45,20.16 25.4,21.11 26.35,21.11 27.3,20.16 R6.1
TD1N
  Top 0.152: J1.5 18.26,13.82 17.14,12.7 15.88,12.7 15.24,13.34 15.24,21.59 19.84,26.19 22.7,26.19 27.94,31.43 28.73,31.43 29.84,32.54 R7.1
TD1P
  Top 0.152: J1.4 16.26,15.14 arc-90 16.52,15.4 16.63,15.4 arc90 16.9,15.67 16.9,15.81 arc90 16.63,16.08 15.88,16.08 arc-90 15.61,16.34 15.61,16.49 arc-90 15.88,16.75 16.63,16.75 arc90 16.9,17.02 16.9,17.16 arc90 16.63,17.43 15.88,17.43 arc-90 15.61,17.7 15.61,17.84 arc-90 15.88,18.11 16.63,18.11 arc90 16.9,18.37 16.9,18.52 arc90 16.63,18.78 16.52,18.78 arc-90 16.26,19.05 16.26,22.13 20,25.88 22.86,25.88 28.1,31.11 28.73,31.11 29.84,30 R8.1
TD_CT  (via drill 0.5)
  Top 0.152: 65.41,17.19 U3.49
  Top 0.229: U3.48 67.37,25.02 C21.1 | U3.49 62.61,17.09 C19.1 | U3.54 66.66,14.59 67.31,15.24 67.31,17.14 65.41,19.05 C17.1
  Top 0.406: C31.1 42.07,18.57 | 42.07,18.57 39.37,18.57 | R32.2 39.37,18.57 | 42.07,18.57 v43.97,18.57 | J1.12 22.87,11.28 30.16,18.57 39.37,18.57 | R31.2 42.07,18.57
  Top 0.61: 53.34,28.57 53.34,26.35 | 53.34,26.35 53.34,23.5 | 53.34,23.5 53.34,22.23 54.29,21.27 C18.1 C19.1 | C23.1 53.34,28.57 | C22.1 53.34,26.35 | C17.1 C16.1 61.27,21.27 60.32,22.23 60.32,25.08 59.05,26.35 53.34,26.35 | C21.1 C20.1 61.27,26.99 59.69,28.57 53.34,28.57 | L3.1 52.86,30.48 53.34,30 53.34,28.57 | v49.85,23.5 53.34,23.5
  Bottom 0.406: v43.97,18.57 48.89,23.5 v49.85,23.5
TD_N
  Top 0.152: R5.2 31.59,22.7 32.54,21.75 D5.2 34.13,21.75 35.08,22.7 R32.1 43.97,22.7 44.29,22.38 44.82,22.38 45.55,21.65 45.55,17.05 45.99,16.62 46.94,16.62 47.47,17.14 L5.2
TD_P
  Top 0.152: L4.2 47.47,15.72 46.94,16.24 45.93,16.24 45.25,16.92 45.25,21.53 44.71,22.07 44.29,22.07 43.98,21.75 R31.1 D5.3 34.77,21.75 34.13,21.11 32.54,21.11 31.59,20.16 R6.2
TDF_N
  Top 0.152: L5.1 50.63,17.14 50.95,16.83 51.59,16.83 51.6,16.83 C25.2 56.52,16.83 56.84,16.5 64.29,16.5 64.38,16.59 U3.50
TDF_P
  Top 0.152: L4.1 50.64,15.72 50.8,15.88 C24.2 56.52,15.88 56.84,16.2 64.29,16.2 64.41,16.09 U3.51
TDON
  Top 0.152: J1.10 17.95,11.28 18.1,11.43 18.1,12.22 18.57,12.7 22.07,12.7 24.13,14.76 24.13,20.32 25.4,21.59 26.35,21.59 27.46,22.7 R5.1
TXD  (via drill 0.25)
  Top 0.152: U3.31 v85.32,16.59 | v94.53,16.59 95.97,16.59 R24.2
  Bottom 0.152: v85.32,16.59 v94.53,16.59
TXOUT
  Top 0.152: R24.1 J4.1
V24ADJ
  Top 0.203: PS1.5 143.54,18.55 R1.2 R1.3
VCAP
  Top 0.254: U3.10 71.87,6.71 72.23,6.35 72.71,6.35 73,6.06 C26.1
VMAIN_N  (via drill 0.25)
  Top 0.152: D2.A
  Top 0.203: Q1.2 30.64,5.88 D2.A | D2.A v31.59,4.6
  Top 0.508: D3.C TP_VN.1
  Bottom 0.203: v31.59,4.6 31.59,1.27
  Bottom 0.508: J1.X6 10.72,3.25 TP_VN.1
  Bottom 1.27: 114.78,1.27 31.59,1.27 15.08,1.27 14.22,2.13 J1.X6 | 114.78,1.27 133.51,1.27 PS1.2 | C1.- 114.78,1.27
VMAIN_P
  Top 0.152: R14.1 | R2.2 30.64,3.01
  Top 0.203: 30.64,3.01 30.64,1.27 | R15.1 33.81,1.27
  Top 0.508: TP_VP.1 R14.1 | R14.1 3.97,19.21 3.49,18.73 3.49,8.57 10.79,1.27 19.21,1.27 20.31,2.38
  Top 1.27: J1.X1 20.31,2.38 20.31,2.07 21.11,1.27 30.64,1.27 33.81,1.27 113.35,1.27 C1.+ 136.53,7.78 PS1.3

### Text on the board
_tsilk: 3V3 | GND | BLN | LAT | DAT | CLK | GND | GND | GND | 24V | 24V | 24V | PS2 | C2 | C12 | C11 | D6 | TP_3V3 | R7 | R34 | C15 | D7 | TP_GND | R33 | L3 | U4 | R18 | TP_EGND | R8 | C23 | C20 | C21 | C33 | D8 | R19 | C14 | C13 | TP_24V | OSC1 | C32 | C22 | R9 | R5 | D5 | R25 | C27 | GND | TP_VP | R32 | C18 | C19 | C16 | C17 | R28 | R31 | RXI | J6 | R6 | TXO | R14 | L5 | C25 | C24 | J4 | C31 | R30 | D12 | L4 | C28 | R24 | C1 | R1 | D3 | R22 | R27 | C30 | D11 | Q1 | U2 | R26 | R23 | TP_VN | R3 | R17 | D10 | U3 | C29 | * | R4 | D13 | D2 | D1 | R15 | C26 | R2 | J1 | PS1
_bsilk: C6 | 3V3 | GND | BLN | LAT | DAT | CLK | GND | GND | GND | 24V | 24V | 24V | J5 | J2 | GND | RXI | TXO